# EAGLE design maple-jtagadapter (EAGLE 5.10)
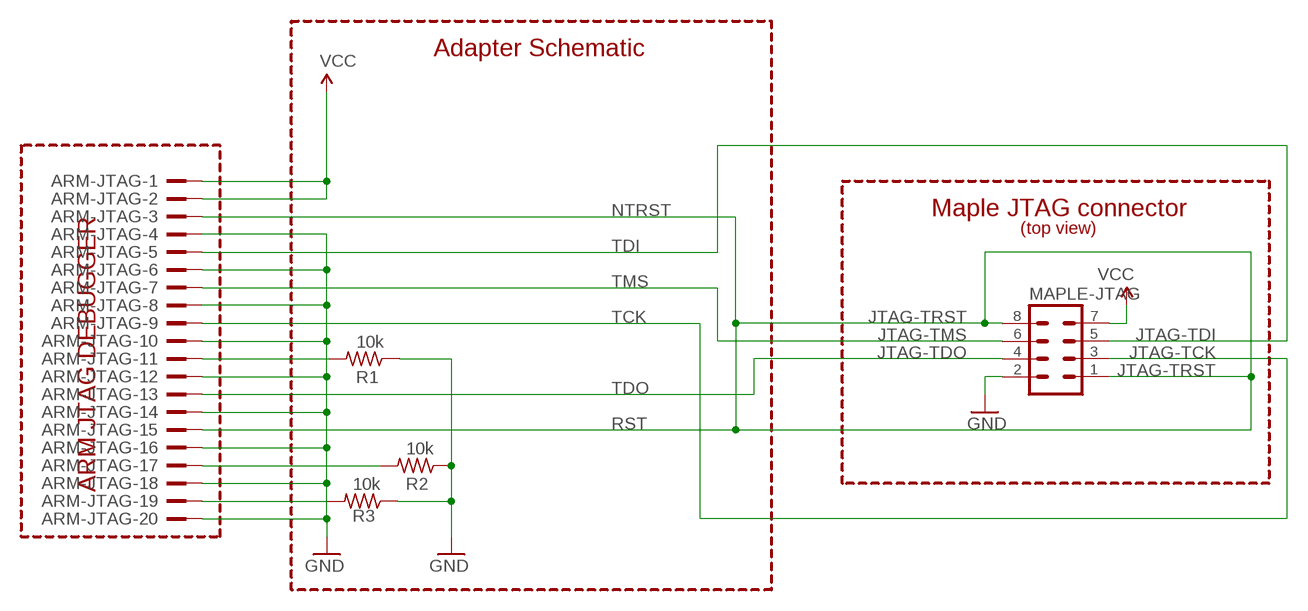
[diagram p0: schematic, sheet 1]

## Parts
ARM-JTAG  2520-  [PAK100/2500-20]
MAPLE-JTAG  MA04-2  [MA04-2]
R1  10k  R-US_0207/10  [0207/10]
R2  10k  R-US_0207/10  [0207/10]
R3  10k  R-US_0207/10  [0207/10]

## Nets
GND: ARM-JTAG.4 ARM-JTAG.6 ARM-JTAG.8 ARM-JTAG.10 ARM-JTAG.12 ARM-JTAG.14 ARM-JTAG.16 ARM-JTAG.18 ARM-JTAG.20 MAPLE-JTAG.2 R1.1 R2.1 R3.1
JTAG-TCK: ARM-JTAG.9 MAPLE-JTAG.3
JTAG-TDI: ARM-JTAG.5 MAPLE-JTAG.5
JTAG-TDO: ARM-JTAG.13 MAPLE-JTAG.4
JTAG-TMS: ARM-JTAG.7 MAPLE-JTAG.6
JTAG-TRST: ARM-JTAG.3 ARM-JTAG.15 MAPLE-JTAG.1 MAPLE-JTAG.8
N$140: ARM-JTAG.11 R1.2
N$141: ARM-JTAG.17 R2.2
N$142: ARM-JTAG.19 R3.2
VCC: ARM-JTAG.1 ARM-JTAG.2 MAPLE-JTAG.7

## Notes on the sheet
- Adapter Schematic
- ARM JTAG DEBUGGER | NTRST | Maple JTAG connector
- (top view)
- TDI
- TMS
- TCK
- TDO
- RST

## Library data of the parts
ARM-JTAG = con-3m:2520-: 3M (TM) Pak 100 4-Wall Header Source: 3M
MAPLE-JTAG = con-lstb:MA04-2: PIN HEADER
R1-R3 = resistor:R-US_: RESISTOR, American symbol

## Net classes
0 default: width 0.203 mm
1 vcc: width 0.254 mm

## Board
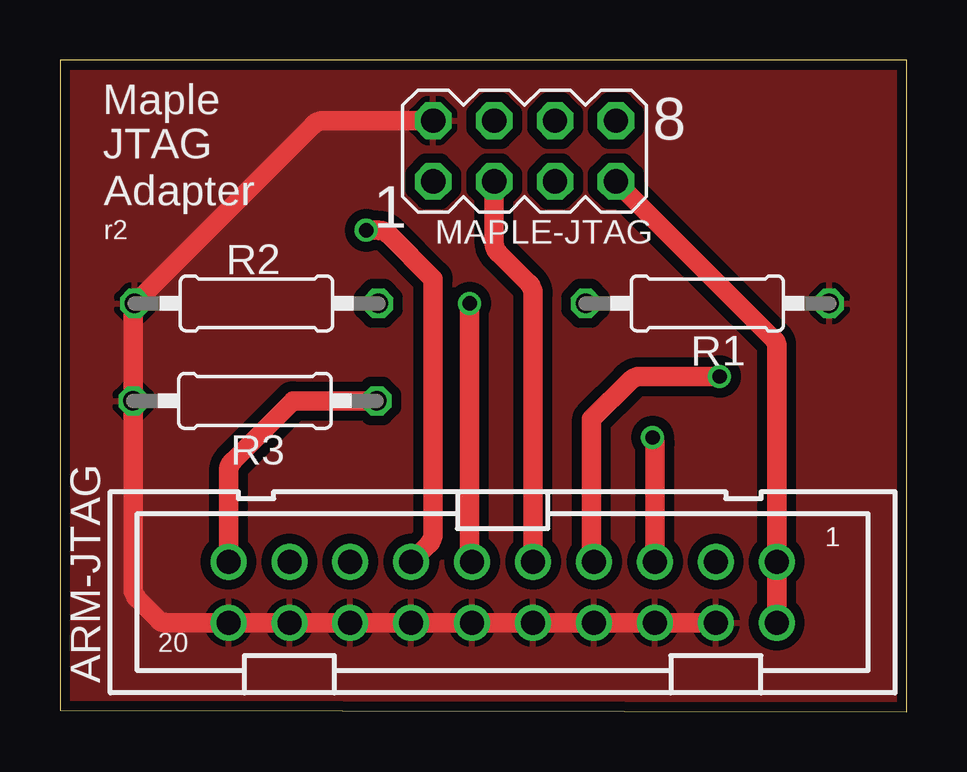
[diagram p1: board, top side]
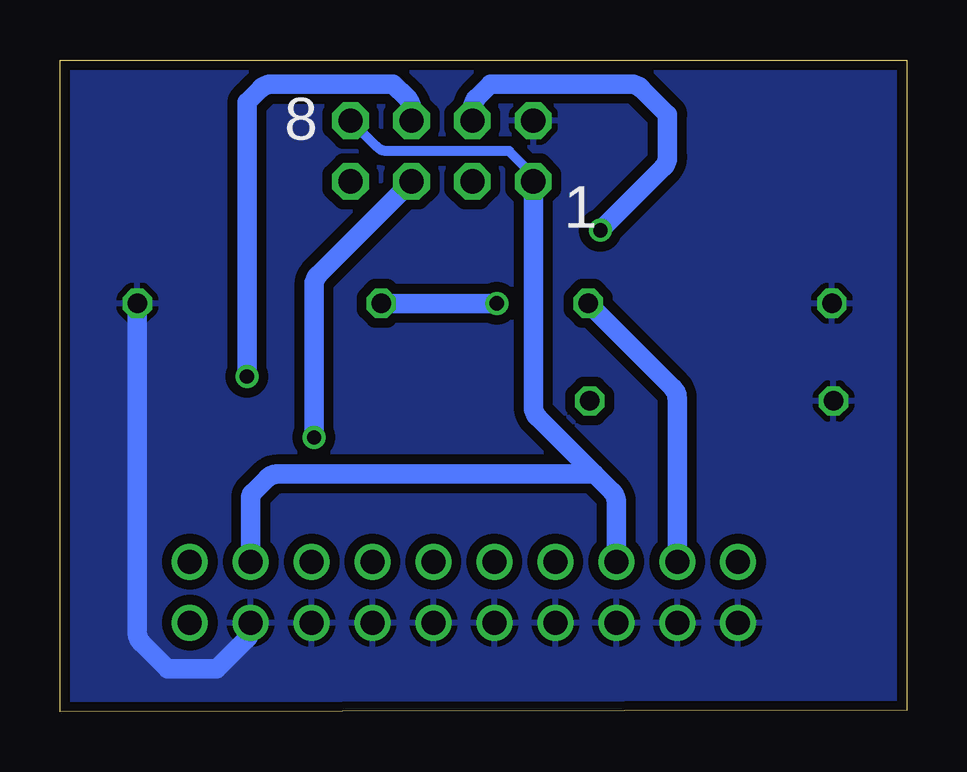
[diagram p2: board, bottom side, seen from below]

Size 35.29 x 27.17 mm. Coordinates in mm from the lower left corner, seen from the top.
Outline: 0,0.06 35.29,0 35.29,27.17 0,27.17 0,0.06
Copper layers (1*16): Top 0.0356mm / dielectric 1.5011mm / Bottom 0.0356mm
Design rules "LaenPCBOrder": minimum track width 6mil, minimum drill 13mil, track to track 6mil, track to pad 6mil, pad to pad 6mil, via to via 6mil, smd to smd 6mil, copper to edge 15mil, drill to drill 6mil, minimum pad ring 7mil, minimum via ring 7mil, stop-mask expansion 4mil, vias tented up to drill 0mil, thermal gap 10mil

### Footprints (pad centres in the part's own frame; a part is rotated, then mirrored left to right if it is on the bottom)
PAK100/2500-20 = drill 1 pad 1.422 round: 1 -11.43,-1.27; 2 -11.43,1.27; 3 -8.89,-1.27; 4 -8.89,1.27; 5 -6.35,-1.27; 6 -6.35,1.27; 7 -3.81,-1.27; 8 -3.81,1.27; 9 -1.27,-1.27; 10 -1.27,1.27; 11 1.27,-1.27; 12 1.27,1.27; 13 3.81,-1.27; 14 3.81,1.27; 15 6.35,-1.27; 16 6.35,1.27; 17 8.89,-1.27; 18 8.89,1.27; 19 11.43,-1.27; 20 11.43,1.27
MA04-2 = drill 1.016 octagon: 1 -3.81,-1.27; 2 -3.81,1.27; 3 -1.27,-1.27; 4 -1.27,1.27; 5 1.27,-1.27; 6 1.27,1.27; 7 3.81,-1.27; 8 3.81,1.27
0207/10 = drill 0.813 octagon: 1 -5.08,0; 2 5.08,0

### Placement (x,y rotation side)
ARM-JTAG  18.45,4.98 180 top
MAPLE-JTAG  19.37,23.37 0 top
R1  26.99,17.02 180 top
R2  8.19,17.02 0 top
R3  8.13,12.95 0 top

### Tracks (layer width: path | path; a pad name or v marks a point on that pad's centre or on a via)
GND
  Top 0.813: ARM-JTAG.4 ARM-JTAG.6 ARM-JTAG.8 ARM-JTAG.10 ARM-JTAG.12 ARM-JTAG.14 ARM-JTAG.16 ARM-JTAG.18 ARM-JTAG.20 4.37,3.71 arc-45 4.13,3.81 3.23,4.7 arc-45 3.05,5.15 R3.1 3.05,16.87 arc-45 R2.1 10.55,24.45 arc-45 10.99,24.64 MAPLE-JTAG.2
  Bottom 0.813: R1.1 32.07,3.31 arc-45 31.88,2.86 30.8,1.78 28.77,1.78 27.53,3.01 arc-45 27.34,3.46 ARM-JTAG.4
  pour Top (isolate 0.406): 0.32,26.92 35.12,26.92 35.12,24.38 35.12,0.25 0.32,0.25
  pour Bottom (isolate 0.406): 0.32,26.92 34.86,26.92 35.12,26.92 35.12,0.25 0.32,0.25
JTAG-TCK
  Top 0.813: MAPLE-JTAG.3 18.1,19.57 arc45 18.28,19.12 19.54,17.86 arc-45 19.72,17.42 ARM-JTAG.9
JTAG-TDI  (via drill 0.6)
  Top 0.813: v24.7,11.43 arc-45 24.8,11.19 ARM-JTAG.5
  Bottom 0.813: MAPLE-JTAG.5 24.52,18.22 arc-45 24.7,17.77 v24.7,11.43
JTAG-TDO  (via drill 0.6)
  Top 0.813: ARM-JTAG.13 15.37,6.98 arc45 15.56,7.43 15.56,18.03 13.71,19.88 arc45 13.26,20.07 v12.76,20.07
  Bottom 0.813: MAPLE-JTAG.4 18.1,25.14 arc45 17.91,25.59 17.34,26.16 11.5,26.16 arc45 11.05,25.98 9.97,24.89 9.97,23.12 arc45 10.16,22.67 v12.76,20.07
JTAG-TMS  (via drill 0.6)
  Top 0.813: v27.5,13.97 24.2,13.97 arc45 23.75,13.78 22.16,12.19 22.16,6.49 arc45 ARM-JTAG.7
  Bottom 0.813: MAPLE-JTAG.6 20.64,25.14 arc-45 20.82,25.59 21.4,26.16 26.47,26.16 arc-45 26.92,25.98 27.5,25.4 v27.5,13.97
JTAG-TRST
  Bottom 0.406: MAPLE-JTAG.8 22.09,23.55 arc-45 21.64,23.37 16.57,23.37 15.74,22.53 arc45 MAPLE-JTAG.1
  Bottom 0.813: ARM-JTAG.15 12.1,8.73 arc-45 12.29,9.18 13.02,9.91 | 13.02,9.91 26.22,9.91 arc-45 26.67,9.72 27.24,9.14 arc-45 27.34,8.9 ARM-JTAG.3 | MAPLE-JTAG.1 15.56,12.71 arc-45 15.37,12.26 13.02,9.91
N$1  (via drill 0.6)
  other vias: 12.76,20.07
N$2  (via drill 0.6)
  other vias: 17.08,17.02
N$3  (via drill 0.6)
  other vias: 24.7,11.43
N$4  (via drill 0.6)
  other vias: 27.5,13.97
N$140  (via drill 0.6)
  Top 0.813: v17.08,17.02 17.08,6.49 arc45 ARM-JTAG.11
  Bottom 0.813: v17.08,17.02 R1.2
N$141
  Bottom 0.813: ARM-JTAG.17 9.56,13.05 arc-45 9.75,13.5 R2.2
N$142
  Top 0.813: ARM-JTAG.19 7.02,10 arc-45 7.21,10.45 9.72,12.95 R3.2
VCC
  Top 0.813: MAPLE-JTAG.7 29.78,15.49 arc-45 29.88,15.25 ARM-JTAG.1 ARM-JTAG.2

### Text on the board
tNames: Maple | JTAG | 8 | Adapter | 1 | r2 | 1 | 20
bNames: 8 | 1